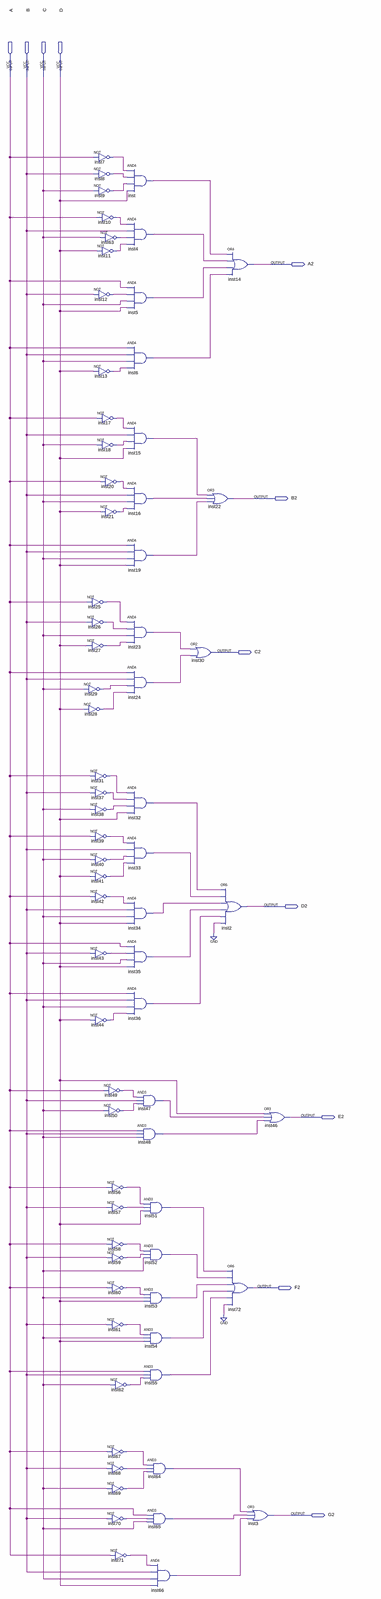
[diagram p0: schematic sheet, whole]
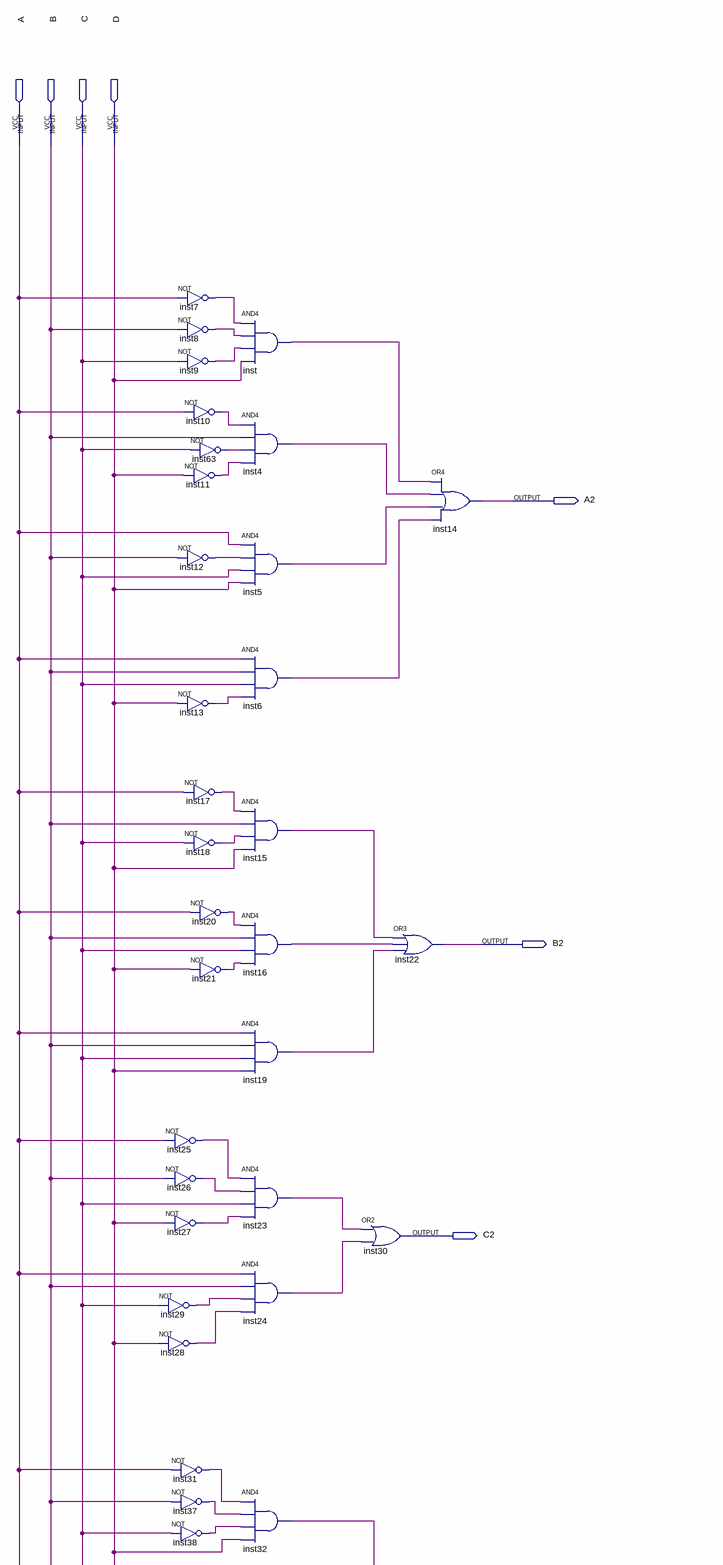
[diagram p1: schematic sheet, upper part]
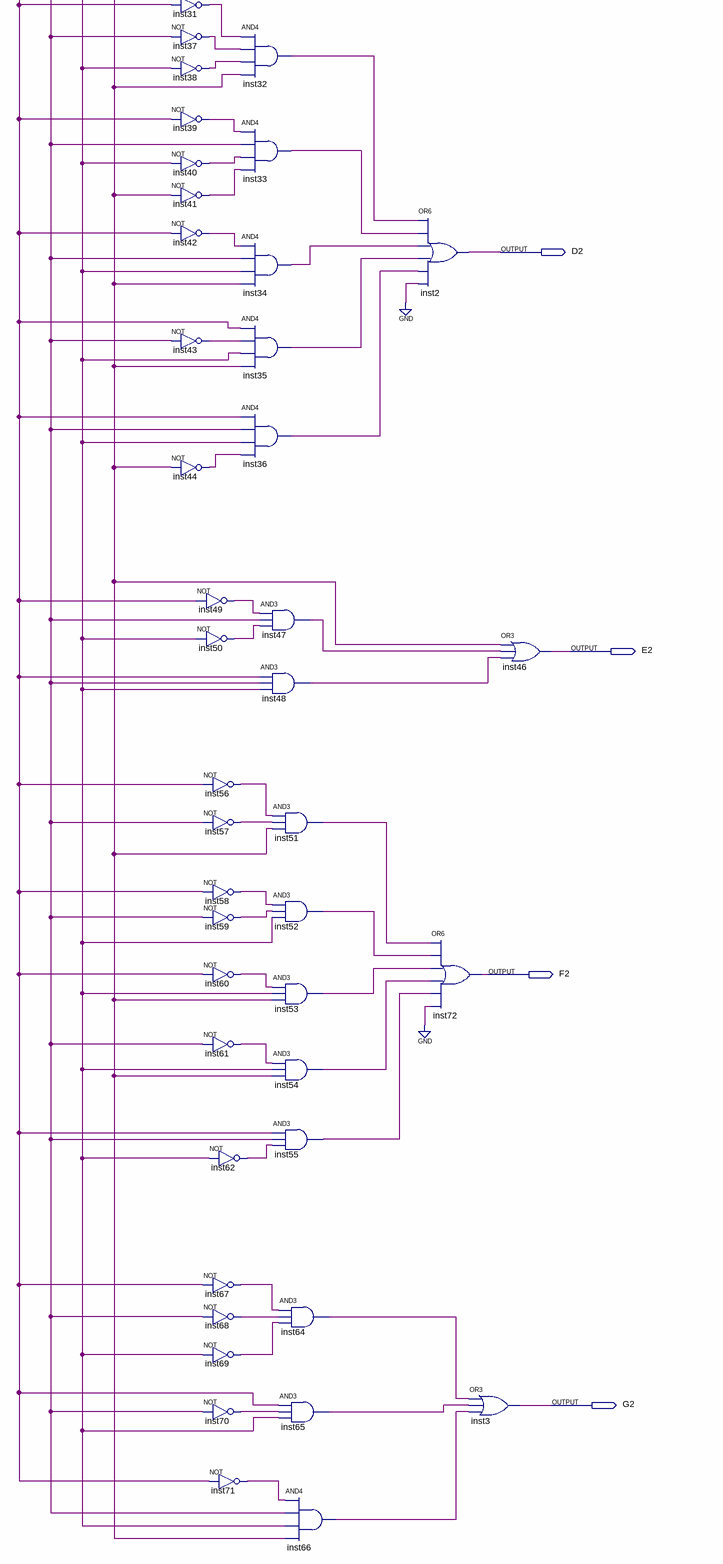
[diagram p2: schematic sheet, lower part]
// Quartus schematic display2.bdf as structural Verilog: 71 symbols, 11 pins
module display2 (
  input  A,
  input  B,
  input  C,
  input  D,
  output A2,
  output B2,
  output C2,
  output D2,
  output E2,
  output F2,
  output G2
);

  wire inst4_out, inst5_out, inst6_out, inst7_out, inst8_out, inst9_out, inst10_out, inst11_out, inst12_out,
       inst13_out, inst15_out, inst16_out, inst17_out, inst18_out, inst19_out, inst20_out, inst21_out,
       inst23_out, inst24_out, inst25_out, inst26_out, inst27_out, inst28_out, inst29_out, inst31_out,
       inst32_out, inst33_out, inst34_out, inst35_out, inst36_out, inst37_out, inst38_out, inst39_out,
       inst40_out, inst41_out, inst42_out, inst43_out, inst44_out, inst47_out, inst48_out, inst49_out,
       inst50_out, inst51_out, inst52_out, inst53_out, inst54_out, inst55_out, inst56_out, inst57_out,
       inst58_out, inst59_out, inst60_out, inst61_out, inst62_out, inst63_out, inst64_out, inst65_out,
       inst66_out, inst67_out, inst68_out, inst69_out, inst70_out, inst71_out, inst_out;

  not inst7 (inst7_out, A);
  not inst8 (inst8_out, B);
  not inst9 (inst9_out, C);
  not inst10 (inst10_out, A);
  not inst63 (inst63_out, C);
  not inst11 (inst11_out, D);
  not inst12 (inst12_out, B);
  not inst13 (inst13_out, D);
  not inst17 (inst17_out, A);
  not inst18 (inst18_out, C);
  not inst20 (inst20_out, A);
  not inst21 (inst21_out, D);
  not inst25 (inst25_out, A);
  not inst26 (inst26_out, B);
  not inst27 (inst27_out, D);
  not inst29 (inst29_out, C);
  not inst28 (inst28_out, D);
  not inst31 (inst31_out, A);
  not inst37 (inst37_out, B);
  not inst38 (inst38_out, C);
  not inst39 (inst39_out, A);
  not inst40 (inst40_out, C);
  not inst41 (inst41_out, D);
  not inst42 (inst42_out, A);
  not inst43 (inst43_out, B);
  not inst44 (inst44_out, D);
  and inst (inst_out, inst7_out, inst8_out, inst9_out, D);
  and inst4 (inst4_out, inst10_out, B, inst63_out, inst11_out);
  and inst5 (inst5_out, A, inst12_out, C, D);
  and inst6 (inst6_out, A, B, C, inst13_out);
  and inst15 (inst15_out, inst17_out, B, inst18_out, D);
  and inst16 (inst16_out, inst20_out, B, C, inst21_out);
  and inst19 (inst19_out, A, B, C, D);
  and inst23 (inst23_out, inst25_out, inst26_out, C, inst27_out);
  and inst24 (inst24_out, A, B, inst29_out, inst28_out);
  and inst32 (inst32_out, inst31_out, inst37_out, inst38_out, D);
  and inst33 (inst33_out, inst39_out, B, inst40_out, inst41_out);
  and inst34 (inst34_out, inst42_out, B, C, D);
  and inst35 (inst35_out, A, inst43_out, C, D);
  and inst36 (inst36_out, A, B, C, inst44_out);
  not inst49 (inst49_out, A);
  not inst50 (inst50_out, C);
  not inst56 (inst56_out, A);
  not inst57 (inst57_out, B);
  not inst58 (inst58_out, A);
  not inst59 (inst59_out, B);
  not inst60 (inst60_out, A);
  not inst61 (inst61_out, B);
  not inst62 (inst62_out, C);
  not inst67 (inst67_out, A);
  not inst68 (inst68_out, B);
  not inst69 (inst69_out, C);
  not inst70 (inst70_out, B);
  not inst71 (inst71_out, A);
  and inst47 (inst47_out, inst49_out, B, inst50_out);
  and inst48 (inst48_out, A, B, C);
  and inst51 (inst51_out, inst56_out, inst57_out, D);
  and inst52 (inst52_out, inst58_out, inst59_out, C);
  and inst53 (inst53_out, inst60_out, C, D);
  and inst54 (inst54_out, inst61_out, C, D);
  and inst55 (inst55_out, A, B, inst62_out);
  and inst64 (inst64_out, inst67_out, inst68_out, inst69_out);
  and inst65 (inst65_out, A, inst70_out, C);
  and inst66 (inst66_out, inst71_out, B, C, D);
  or inst22 (B2, inst15_out, inst16_out, inst19_out);
  or inst30 (C2, inst23_out, inst24_out);
  or inst14 (A2, inst_out, inst4_out, inst5_out, inst6_out);
  or inst2 (D2, inst32_out, inst33_out, inst34_out, inst35_out, inst36_out, 1'b0);
  or inst72 (F2, inst51_out, inst52_out, inst53_out, inst54_out, inst55_out, 1'b0);
  or inst3 (G2, inst64_out, inst65_out, inst66_out);
  or inst46 (E2, D, inst47_out, inst48_out);
endmodule
